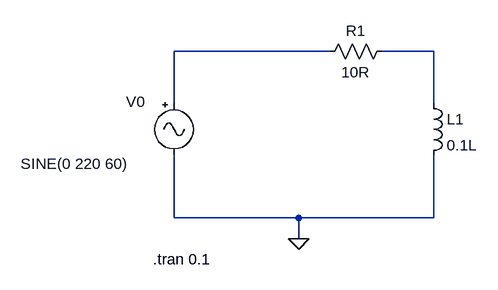
[diagram p0: schematic Circuito_sem_capacitor.asc]
Circuito_sem_capacitor.asc, the LTspice schematic file:
Version 4
SHEET 1 880 680
WIRE 240 64 0 64
WIRE 400 64 320 64
WIRE 0 144 0 64
WIRE 400 144 400 64
WIRE 0 320 0 224
WIRE 192 320 0 320
WIRE 400 320 400 224
WIRE 400 320 192 320
WIRE 192 352 192 320
FLAG 192 352 0
SYMBOL Misc\\signal 0 128 R0
WINDOW 123 0 0 Left 0
WINDOW 39 0 0 Left 0
WINDOW 0 -74 13 Left 2
WINDOW 3 -236 109 Left 2
SYMATTR InstName V0
SYMATTR Value SINE(0 220 60)
SYMBOL res 336 48 R90
WINDOW 0 0 56 VBottom 2
WINDOW 3 32 56 VTop 2
SYMATTR InstName R1
SYMATTR Value 10R
SYMBOL ind 384 128 R0
SYMATTR InstName L1
SYMATTR Value 0.1L
TEXT -32 384 Left 2 !.tran 0.1

The netlist it stands for:
* Circuito_sem_capacitor.asc
V0 N001 0 SINE(0 220 60)
R1 N002 N001 10R
L1 N002 0 0.1L
.tran 0.1
.backanno
.end